# Altium schematic sheet AIM2 - ADCS REVB.SchDoc: External Interfaces
size B; DrawnBy: DJW; DocumentNumber: 3; SheetNumber: 3; SheetTotal: 12; PageSetup: Record=PageOptions|CenterHorizontal=True|CenterVertical=True|PrintScale=0.72|XCorrection=1.00|YCorrection=1.00|PrintKind=1|BorderSize=5000000|LeftOffset=0|BottomOffset=0|Orientation=2|PaperLength=1000|PaperWidth=1000|Scale=100|PaperSource=7|PrintQuality=600|MediaType=1|DitherType=10|PrintScaleMode=1|PaperKind=Letter|PaperIndex=1
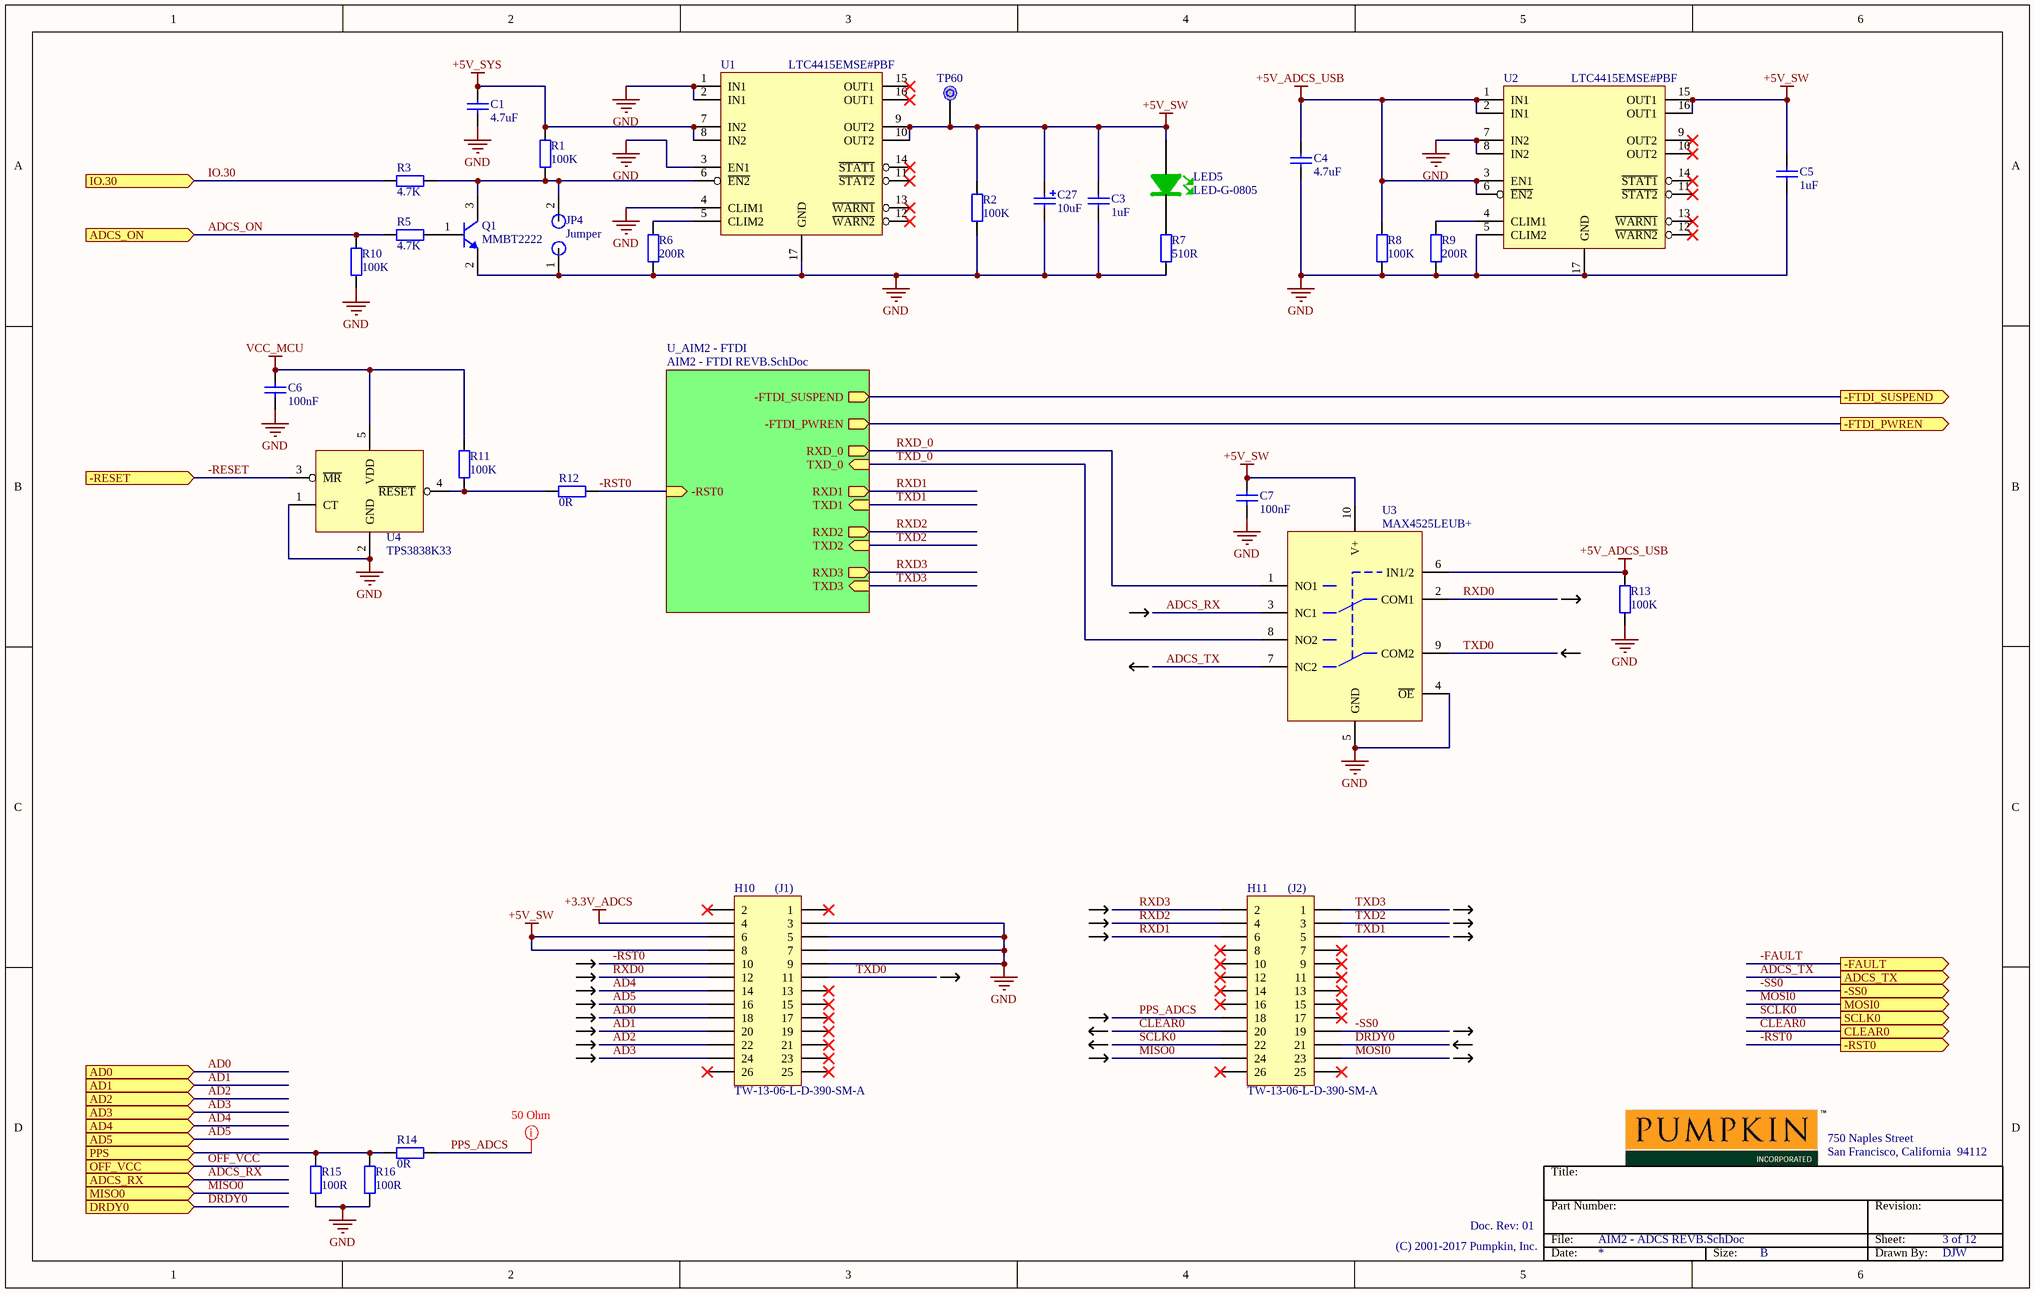
[diagram p0: AIM2 - ADCS REVB.SchDoc]

## Parts
C1  4.7uF  [0805 CAP]
C3  1uF  [0805 CAP]
C4  4.7uF  [0805 CAP]
C5  1uF  [0805 CAP]
C6  100nF  [0603 CAP]
C7  100nF  [0603 CAP]
C27  10uF  [6032 POLAR CAP]
H10  TW-13-06-L-D-390-SM-A  [TW-13-06-X-D-390-SM-A]
H11  TW-13-06-L-D-390-SM-A  [TW-13-06-X-D-390-SM-A]
JP4  Jumper  [0805 RES 1 way jumper]
LED5  LED-G-0805  [0805 LED-GREEN]
Q1  MMBT2222  [SOT23-3]
R1  100K  [0805 RES]
R2  100K  [0805 RES]
R3  4.7K  [0805 RES]
R5  4.7K  [0805 RES]
R6  200R  [0805 RES]
R7  510R  [0805 RES]
R8  100K  [0805 RES]
R9  200R  [0805 RES]
R10  100K  [0805 RES]
R11  100K  [0805 RES]
R12  0R  [0805 RES]
R13  100K  [0805 RES]
R14  0R  [0805 RES]
R15  100R  [0805 RES]
R16  100R  [0805 RES]
TP60  Testpoint  [Testpoint]  (value not drawn)  (no BOM)
U1  LTC4415EMSE#PBF  [MSOP-16]
U2  LTC4415EMSE#PBF  [MSOP-16]
U3  MAX4525LEUB+  [MSOP-10]
U4  TPS3838K33  [SOT23-5]

## Sub-sheets
U_AIM2 - FTDI = AIM2 - FTDI REVB.SchDoc: -RST0 (in), -FTDI_SUSPEND (out), -FTDI_PWREN (out), TXD_0 (in), RXD_0 (out), TXD1 (in), RXD1 (out), TXD2 (in), RXD2 (out), TXD3 (in), RXD3 (out)

## Ports
-FAULT (out), -FTDI_PWREN (out), -FTDI_SUSPEND (out), -RESET (in), -RST0 (out), -SS0 (out), AD0 (in), AD1 (in), AD2 (in), AD3 (in), AD4 (in), AD5 (in), ADCS_ON (in), ADCS_RX (in), ADCS_TX (out), CLEAR0 (out), DRDY0 (in), IO.30 (in), MISO0 (in), MOSI0 (out), OFF_VCC (in), PPS (in), SCLK0 (out)

## Nets
+3.3V_ADCS: H10.4
+5V_ADCS_USB: C4.2 R8.2 R13.2 U2.1(IN1) U2.2(IN1) U2.3(EN1) U2.6(~{EN2}) U3.6(IN1/2)
+5V_SW: C3.2 C5.2 C7.2 C27.1 H10.6 H10.8 LED5.2 R2.2 TP60.1 U1.9(OUT2) U1.10(OUT2) U2.15(OUT1) U2.16(OUT1) U3.10(V+)
+5V_SYS: C1.2 R1.2 U1.7(IN2) U1.8(IN2)
GND: C1.1 C3.1 C4.1 C5.1 C6.1 C7.1 C27.2 H10.3 H10.5 H10.7 H10.9 JP4.1 Q1.2(E) R2.1 R6.1 R7.1 R8.1 R9.1 R10.1 R13.1 R15.1 R16.1 U1.1(IN1) U1.2(IN1) U1.3(EN1) U1.4(CLIM1) U1.17(GND) U2.5(CLIM2) U2.7(IN2) U2.8(IN2) U2.17(GND) U3.4(~{OE}) U3.5(GND) U4.1(CT) U4.2(GND)
VCC_MCU: C6.2 R11.2 U4.5(VDD)
-FAULT: port -FAULT
-FTDI_PWREN: port -FTDI_PWREN, sheet U_AIM2 - FTDI/-FTDI_PWREN
-FTDI_SUSPEND: port -FTDI_SUSPEND, sheet U_AIM2 - FTDI/-FTDI_SUSPEND
-RESET: U4.3(~{MR}) ; port -RESET
-RST0: H10.10 R12.2 ; port -RST0, sheet U_AIM2 - FTDI/-RST0
-SS0: H11.19 ; port -SS0
AD0: H10.18 ; port AD0
AD1: H10.20 ; port AD1
AD2: H10.22 ; port AD2
AD3: H10.24 ; port AD3
AD4: H10.14 ; port AD4
AD5: H10.16 ; port AD5
ADCS_ON: R5.1 R10.2 ; port ADCS_ON
ADCS_RX: U3.3(NC1) ; port ADCS_RX
ADCS_TX: U3.7(NC2) ; port ADCS_TX
CLEAR0: H11.20 ; port CLEAR0
DRDY0: H11.21 ; port DRDY0
IO.30: R3.1 ; port IO.30
MISO0: H11.24 ; port MISO0
MOSI0: H11.23 ; port MOSI0
OFF_VCC: port OFF_VCC
PPS: R14.1 R15.2 R16.2 ; port PPS
PPS_ADCS: H11.18 R14.2
RXD0: H10.12 U3.2(COM1)
RXD1: H11.6 ; sheet U_AIM2 - FTDI/RXD1
RXD2: H11.4 ; sheet U_AIM2 - FTDI/RXD2
RXD3: H11.2 ; sheet U_AIM2 - FTDI/RXD3
RXD_0: U3.1(NO1) ; sheet U_AIM2 - FTDI/RXD_0
SCLK0: H11.22 ; port SCLK0
TXD0: H10.11 U3.9(COM2)
TXD1: H11.5 ; sheet U_AIM2 - FTDI/TXD1
TXD2: H11.3 ; sheet U_AIM2 - FTDI/TXD2
TXD3: H11.1 ; sheet U_AIM2 - FTDI/TXD3
TXD_0: U3.8(NO2) ; sheet U_AIM2 - FTDI/TXD_0
NetJP4_2: JP4.2 Q1.3(C) R1.1 R3.2 U1.6(~{EN2})
NetLED5_1: LED5.1 R7.2
NetQ1_1: Q1.1(B) R5.2
NetR6_2: R6.2 U1.5(CLIM2)
NetR9_2: R9.2 U2.4(CLIM1)
NetR11_1: R11.1 R12.1 U4.4(~{RESET})

Not connected (* = marked no-connect by the designer): H10 1* 2* 13* 15* 17* 19* 21* 23* 25* 26*; H11 7* 8* 9* 10* 11* 12* 13* 14* 15* 16* 17* 25* 26*; U1 11(~{STAT2})* 12(~{WARN2})* 13(~{WARN1})* 14(~{STAT1})* 15(OUT1)* 16(OUT1)*; U2 9(OUT2)* 10(OUT2)* 11(~{STAT2})* 12(~{WARN2})* 13(~{WARN1})* 14(~{STAT1})*

## Layout directives
net class 50 Ohm: PPS_ADCS

## Notes on the sheet
- (near H10) (J1)
- (near H11) (J2)
- Title:
- 750 Naples Street
- San Francisco, California  94112
- Doc. Rev: 01
- File:
- Part Number:
- Revision:
- Sheet:
- (C) 2001-2017 Pumpkin, Inc.
- Date:
- Size:
- B
- Drawn By:

## Library data of the parts
C1 C4 = Capacitor 4.7uF 0805: Capacitor 4.7uF 0805 X7R 35V 10%; Value: 4.7uF; Supplier 1: Digi-Key; Supplier Part Number 1: 445-172479-1-ND
C3 C5 = Capacitor 1uF 0805: Capacitor 1uF 0805 X7R 25V 10%; Value: 1uF; Supplier 1: Digi-Key; Supplier Part Number 1: 445-5687-1-ND
C6 C7 = Capacitor 100nF 0603: Capacitor 100nF 0603 X7R 50V 5%; Value: 100nF; Supplier 1: Digi-Key; Supplier Part Number 1: 399-7844-1-ND
C27 = Capacitor 10uF 6032 Tantalum: Capacitor 10uF 6032 TANT 16V 10%; Value: 10uF; Supplier 1: Digi-Key; Supplier Part Number 1: 399-3732-1-ND
H10 H11 = 13x2 2mm Header: Header 13x2 TH 2mm pitch; Supplier 1: Newark; Supplier Part Number 1: 73X0656
JP4 = Jumper 1 way 0805: Jumper 0805 1 pos; Supplier 1: Digi-Key; Supplier Part Number 1: P0.0ACT-ND
LED5 = LED GREEN 0805: Supplier 1: Digi-Key; Supplier Part Number 1: 160-1414-1-ND
Q1 = MMBT2222ALT1GOSCT-ND: Transistor NPN; Supplier 1: Digi-Key; Supplier Part Number 1: MMBT2222ALT1GOSCT-ND
R1 R2 R8 R10 R11 R13 = Resistor 100K 0805: Resistor 100K 0805 0.5W 1%; Revision: Altium ETH 11-03.2008; Value: 100K; Supplier 1: Digi-Key; Supplier Part Number 1: P16060CT-ND
R3 R5 = Resistor 4K7 0805: Resistor 4.7K 0805 0.125W 1%; Revision: Altium ETH 11-03.2008; Value: 4.7K; Supplier 1: Digi-Key; Supplier Part Number 1: 311-4.70KCRCT-ND
R6 R9 = Resistor 200R 0805: Resistor 200R 0805 0.125W 1%; Revision: Altium ETH 11-03.2008; Value: 200R; Supplier 1: Digi-Key; Supplier Part Number 1: 311-200CRCT-ND
R7 = Resistor 510R 0805: Resistor 470K 0805 0.125W 1%; Revision: Altium ETH 11-03.2008; Value: 510R; Supplier 1: Digi-Key; Supplier Part Number 1: 311-470KCRCT-ND
R12 R14 = Resistor 0R 0805: Resistor 0R 0805 0.125W; Revision: Altium ETH 11-03.2008; Value: 0R; Supplier 1: Digi-Key; Supplier Part Number 1: P0.0ACT-ND
R15 R16 = Resistor 100R 0805: Resistor 100R 0805 0.125W 1%; Revision: Altium ETH 11-03.2008; Value: 100R; Supplier 1: Digi-Key; Supplier Part Number 1: P100CCT-ND
U1 U2 = LTC4415: IC Driver Dual Idewal Diode; Supplier 1: Digi-Key; Supplier Part Number 1: LTC4415EMSE#PBF-ND
U3 = MAX4525LEUB+: IC Analog Switch DPDT; Supplier 1: Digi-Key; Supplier Part Number 1: MAX4525LEUB+-ND
U4 = TPS3838K33DBVR: IC Supervisor Reset; Supplier 1: Digi-Key; Supplier Part Number 1: 296-26956-1-ND